# Altium schematic sheet dianzicheng.SchDoc
size A4
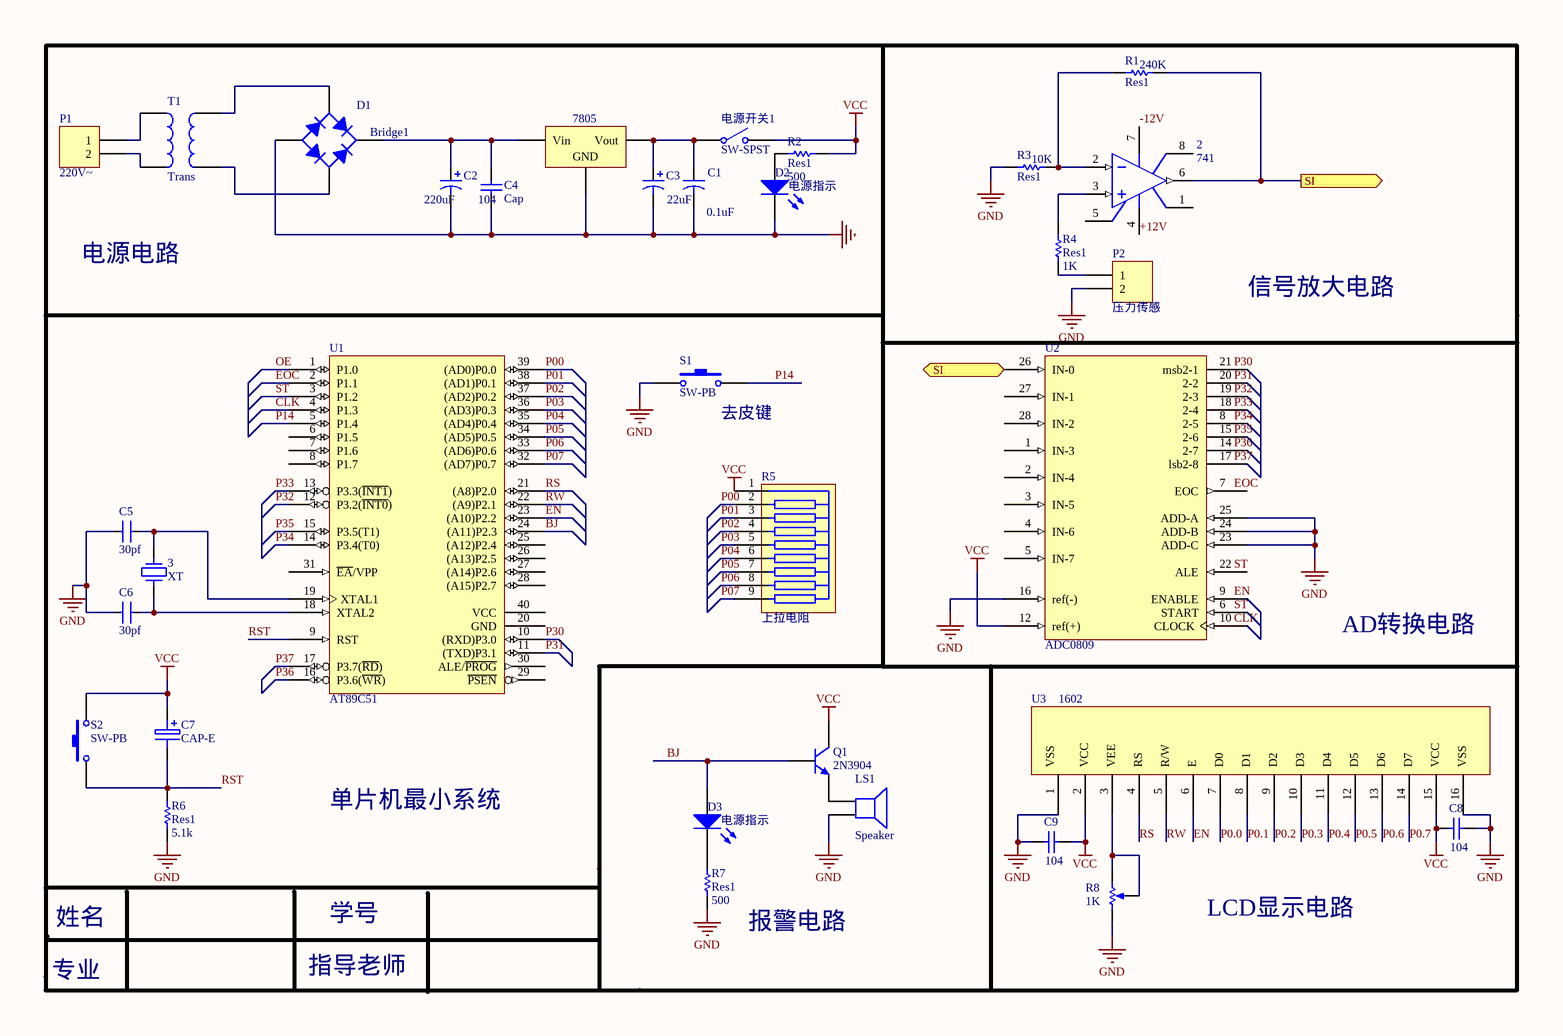
[diagram p0: dianzicheng.SchDoc]

## Parts
2  741  [H-08A]
3  XT  [HC-49S]
7805  (no value)  [SIP-G3/Y2]
C1  value 0.1uF  [CAPR5-4X5]
C2  value 220uF  [CC2012-0805]
C3  value 22uF  [CC2012-0805]
C4  Cap  value 104  [RAD-0.3]
C5  30pf  [0603C]
C6  30pf  [0603C]
C7  CAP-E  [RB.1/.3]
C8  value 104  [RAD-0.3]
C9  value 104  [RAD-0.3]
D1  Bridge1  [D-38]
D2  电源指示  [DSO-F2/D6.1]
D3  电源指示  [DSO-F2/D6.1]
LS1  Speaker  [PIN2]
P1  220V~  [HDR1X2]
P2  压力传感  [HDR1X2]
Q1  2N3904  [TO-92A]
R1  Res1  value 240K  [AXIAL-0.3]
R2  Res1  value 500  [AXIAL-0.3]
R3  Res1  value 10K  [AXIAL-0.3]
R4  Res1  value 1K  [AXIAL-0.3]
R5  上拉电阻  [sip9]
R6  Res1  value 5.1k  [AXIAL-0.3]
R7  Res1  value 500  [AXIAL-0.3]
R8  value 1K  [VR5]
S1  SW-PB  [SPST-2]
S2  SW-PB  [SPST-2]
T1  Trans  [TRANS]
U1  AT89C51  [DIP-40]
U2  ADC0809  [DIP28]
U3  1602
电源开关1  SW-SPST  [SPST-2]

## Ports
SI (in), SI (out)

## Nets
GND: 7805.2(GND) C1.2 C2.2 C3.2 C4.1 C5.2 C6.2 C8.2 C9.1 D1.3(A) D2.2(K) LS1.2 P2.2 R3.1 R6.1 R7.1 R8.1(TOP) S1.1 U2.13(GND) U2.16(ref(-)) U2.23(ADD-C) U2.24(ADD-B) U2.25(ADD-A) U3.1 U3.16
VCC: C7.1 C8.1 C9.2 Q1.3(C) R2.1 R5.1 S2.2 U2.12(ref(+)) U3.2 U3.15 电源开关1.2(NO)
+12V: 2.4(V-)
-12V: 2.7(V+)
BJ: D3.1(A) Q1.2(B) U1.24((A11)P2.3)
CLK: U1.4(P1.3)
EN: U1.23((A10)P2.2) U3.6
EOC: U1.2(P1.1)
OE: U1.1(P1.0)
P00: R5.2 U1.39((AD0)P0.0)
P0.0: U3.7
P0.1: U3.8
P0.2: U3.9
P0.3: U3.10
P0.4: U3.11
P0.5: U3.12
P0.6: U3.13
P0.7: U3.14
P01: R5.3 U1.38((AD1)P0.1)
P02: R5.4 U1.37((AD2)P0.2)
P03: R5.5 U1.36((AD3)P0.3)
P04: R5.6 U1.35((AD4)P0.4)
P05: R5.7 U1.34((AD5)P0.5)
P06: R5.8 U1.33((AD6)P0.6)
P07: R5.9 U1.32((AD7)P0.7)
P14: S1.2 U1.5(P1.4)
P30: U1.10((RXD)P3.0)
P31: U1.11((TXD)P3.1)
P32: U1.12(P3.2(~{INT0}))
P33: U1.13(P3.3(~{INT1}))
P34: U1.14(P3.4(T0))
P35: U1.15(P3.5(T1))
P36: U1.16(P3.6(~{WR}))
P37: U1.17(P3.7(~{RD}))
RS: U1.21((A8)P2.0) U3.4
RST: C7.2 R6.2 S2.1 U1.9(RST)
RW: U1.22((A9)P2.1) U3.5
SI: 2.6(OUT) R1.2 U2.26(IN-0) ; port SI
ST: U1.3(P1.2)
Net2_2: 2.2(IN-) R1.1 R3.2
Net2_3: 2.3(IN+) R4.2
Net3_1: 3.1 C6.1 U1.18(XTAL2)
Net3_2: 3.2 C5.1 U1.19(XTAL1)
Net7805_1: 7805.1(Vin) C2.1 C4.2 D1.1(K)
Net7805_3: 7805.3(Vout) C1.1 C3.1 电源开关1.1(COMMON)
NetD1_2: D1.2(C) T1.4
NetD1_4: D1.4(C) T1.3
NetD2_1: D2.1(A) R2.2
NetD3_2: D3.2(K) R7.2
NetLS1_1: LS1.1 Q1.1(E)
NetP1_1: P1.1 T1.1
NetP1_2: P1.2 T1.2
NetP2_1: P2.1 R4.1
NetR8_2: R8.2(BOT) R8.3(TAP) U3.3

Not connected (* = marked no-connect by the designer): 2 1(OS_NUL) 5(OS_NUL) 8(TAB); U1 6(P1.5) 7(P1.6) 8(P1.7) 20(GND) 25((A12)P2.4) 26((A13)P2.5) 27((A14)P2.6) 28((A15)P2.7) 29(~{PSEN}) 30(ALE/~{PROG}) 31(~{EA}/VPP) 40(VCC); U2 1(IN-3) 2(IN-4) 3(IN-5) 4(IN-6) 5(IN-7) 6(START) 7(EOC) 8(2-5) 9(ENABLE) 10(CLOCK) 14(2-7) 15(2-6) 17(lsb2-8) 18(2-4) 19(2-3) 20(2-2) 21(msb2-1) 22(ALE) 27(IN-1) 28(IN-2)

## Notes on the sheet
- 电源电路
- 信号放大电路
- (near S1) 去皮键
- AD转换电路
- 单片机最小系统
- 学号
- LCD显示电路
- 专业
- 姓名
- 指导老师
- (near R7) 报警电路
- Labels drawn without touching a wire or pin: CLK, EN, EOC, P30, P31, P32, P33, P34, P35, P36, P37, ST
- (in symbol 1602) VSS; VCC; VEE; RS; R/W; E; D0; D1; D2; D3; D4; D5; D6; D7

## Library data of the parts
2 = Op Amp: FET Operational Amplifier; Published: 8-Jun-2000; LatestRevisionDate: 17-Jul-2002; LatestRevisionNote: Re-released for DXP Platform.; DatasheetVersion: REV. B; PackageVersion: 1990; PackageReference: H-08A; Publisher: Altium Limited; PackageDescription: Can; 8 Leads; Pin Circle Dia. 5.08 mm; Lead Dia. 0.53 mm (max); ComponentLink1Description: Manufacturer Link; ComponentLink1URL: http://www.analog.com/
3 = XT: 晶振
7805 = Volt Reg: Voltage Regulator; Published: 24-Mar-1999; LatestRevisionDate: 17-Jul-2002; LatestRevisionNote: Re-released for DXP Platform.; Publisher: Altium Limited; Code_JEDEC: SMD-220
C1 = Cap2: Capacitor; Published: 23-Sep-2002; Publisher: Altium Limited
C2 C3 = Cap Pol3: Polarized Capacitor (Surface Mount); Published: 8-Jun-2000; LatestRevisionDate: 17-Jul-2002; LatestRevisionNote: Re-released for DXP Platform.; PackageReference: C0805; Publisher: Altium Limited
C4 C8 C9 = Cap: Capacitor; Published: 8-Jun-2000; LatestRevisionDate: 17-Jul-2002; LatestRevisionNote: Re-released for DXP Platform.; PackageReference: RAD-0.3; Publisher: Altium Limited
  C4: PackageDescription: Radial Cap, Thru-Hole; 2 Leads; 0.3 in Pin Spacing
C5 C6 = CAP-0.1UF: SMD-CAP
C7 = CAP-E: 电解电容; value: 10up
D1 = Bridge1: Full Wave Diode Bridge; Published: 8-Jun-2000; LatestRevisionDate: 29-May-2009; LatestRevisionNote: Sch pins A & K swapped.; DatasheetVersion: E2732B; PackageReference: D-38; Publisher: Altium Limited; PackageDescription: Bridge Rectifier; 4 Terminals; Body 9.4 x 9.4 mm (typ); Pitch 5.08 mm
D2 D3 = LED2: Typical RED, GREEN, YELLOW, AMBER GaAs LED; Published: 8-Jun-2000; LatestRevisionDate: 17-Jul-2002; LatestRevisionNote: Re-released for DXP Platform.; Publisher: Altium Limited
LS1 = Speaker: Loudspeaker; Published: 24-Mar-1999; LatestRevisionDate: 17-Jul-2002; LatestRevisionNote: Re-released for DXP Platform.; PackageReference: PIN2; Publisher: Altium Limited
P1 P2 = Header 2: Header, 2-Pin; LatestRevisionDate: 17-Jul-2002; LatestRevisionNote: Re-released for DXP Platform.; Publisher: Altium Limited
Q1 = 2N3904: NPN General Purpose Amplifier; Published: 8-Jun-2000; LatestRevisionDate: 15-Jan-2003; LatestRevisionNote: PCB Footprint 'BCY-W3/D4.7' replaced; DatasheetVersion: 1997; PackageVersion: Sep-1998; PackageReference: TO-92A; Publisher: Altium Limited; PackageDescription: TO, Flat Index; 3 In-Line, Axial Leads; Body Dia. 4.5mm; Leads 0.51 x 0.48 mm (max); ComponentLink1Description: Manufacturer Link; ComponentLink1URL: http://www.fairchildsemi.com/; ComponentLink2Description: Datasheet; ComponentLink2URL: http://www.fairchildsemi.com/ds/2N%2F2N3904.pdf
R1-R4 R6 R7 = Res1: Resistor; Published: 8-Jun-2000; LatestRevisionDate: 17-Jul-2002; LatestRevisionNote: Re-released for DXP Platform.; PackageReference: AXIAL-0.3; Publisher: Altium Limited; PackageDescription: Axial Device, Thru-Hole; 2 Leads; 0.3 in Pin Spacing
R5 = 排阻
R8 = RPot: Potentiometer; Sim Note: Enter the Resistance value and the set point into parameter fields.; Set Position: 0.5; Published: 8-Jun-2000; LatestRevisionDate: 17-Jul-2002; LatestRevisionNote: Re-released for DXP Platform.; PackageReference: VR5; Publisher: Altium Limited
S1 S2 = SW-PB: Switch; Published: 24-Mar-1999; LatestRevisionDate: 17-Jul-2002; LatestRevisionNote: Re-released for DXP Platform.; PackageReference: SPST-2; Publisher: Altium Limited
T1 = Trans: Transformer; Published: 24-Mar-1999; LatestRevisionDate: 08-Jul-2005; LatestRevisionNote: Mech Layer 1 removed.; PackageReference: TRANS; Publisher: Altium Limited; PackageDescription: Transformer; 4 Leads
U1 = AT89C51: 8-Bit Microcontroller with 4K Flash ROM
电源开关1 = SW-SPST: Single-Pole, Single-Throw Switch; Published: 24-Mar-1999; LatestRevisionDate: 17-Jul-2002; LatestRevisionNote: Re-released for DXP Platform.; PackageReference: SPST-2; Publisher: Altium Limited; PackageDescription: Switch; 2 Leads